# Altium schematic sheet ESP32.SchDoc
size A4; SheetNumber: 6; SheetTotal: 8
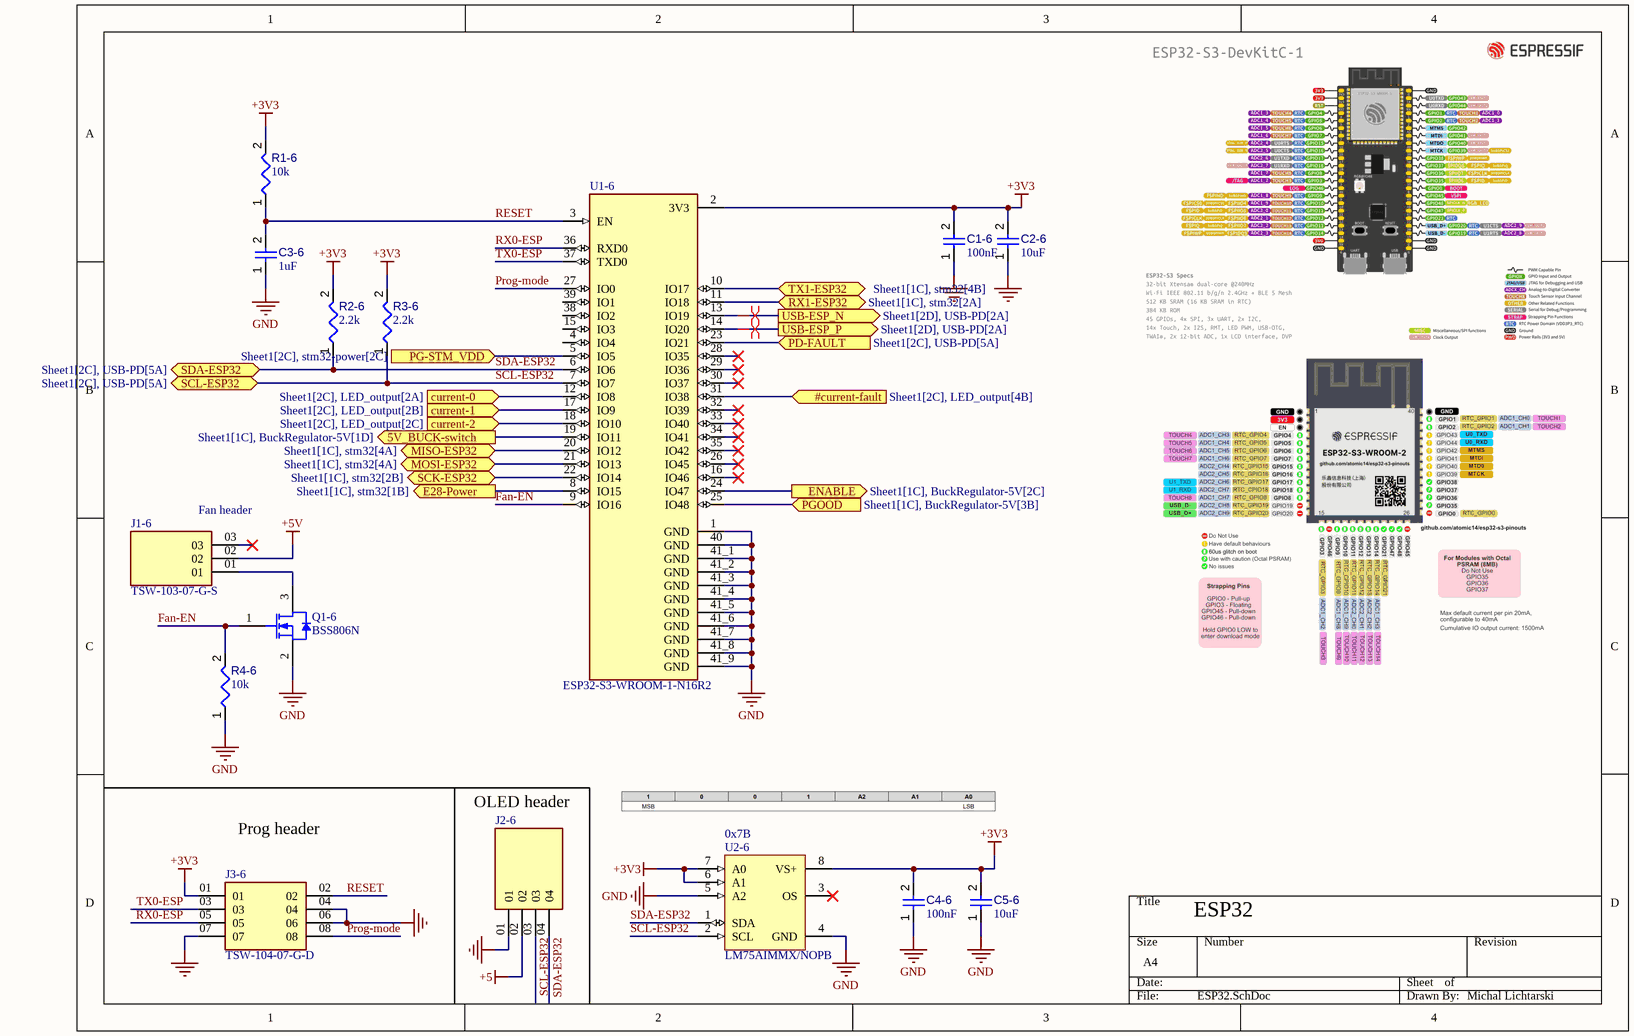
[diagram p0: ESP32.SchDoc]

## Parts
C1-6  value 100nF  [CAPC1608X94X35NL15T15]  (hidden comment: 100nF 0603)
C2-6  value 10uF  [CAPC1608X94X35NL15T15]  (hidden comment: 10uF 0603)
C3-6  value 1uF  [CAPC1608X94X35NL15T15]  (hidden comment: 1uF 0603)
C4-6  value 100nF  [CAPC1608X94X35NL15T15]  (hidden comment: 100nF 0603)
C5-6  value 10uF  [CAPC1608X94X35NL15T15]  (hidden comment: 10uF 0603)
J1-6  TSW-103-07-G-S  [SAMTEC_TSW-103-07-G-S]
J2-6  TSW-104-07-G-S  [SAMTEC_TSW-104-07-G-S]  (value not drawn)
J3-6  TSW-104-07-G-D  [SAMTEC_TSW-104-07-G-D]
Q1-6  BSS806N  [INF-PG-SOT23_M]
R1-6  10k  [RESC1608X55X25ML10T15]
R2-6  2.2k  [RESC1608X55X25ML10T15]
R3-6  2.2k  [RESC1608X55X25ML10T15]
R4-6  10k  [RESC1608X55X25ML10T15]
U1-6  ESP32-S3-WROOM-1-N16R2  [XCVR_ESP32-S3-WROOM-1-N16R2]
U2-6  LM75AIMMX/NOPB  [DGK0008A_M]

## Ports
5V_BUCK-switch (out, see Sheet1[1C], BuckRegulator-5V[1D]), #current-fault (in, see Sheet1[2C], LED_output[4B]), current-0 (in, see Sheet1[2C], LED_output[2A]), current-1 (in, see Sheet1[2C], LED_output[2B]), current-2 (in, see Sheet1[2C], LED_output[2C]), E28-Power (out, see Sheet1[1C], stm32[1B]), ENABLE (out, see Sheet1[1C], BuckRegulator-5V[2C]), MISO-ESP32 (bidir, see Sheet1[1C], stm32[4A]), MOSI-ESP32 (bidir, see Sheet1[1C], stm32[4A]), PD-FAULT (in, see Sheet1[2C], USB-PD[5A]), PG-STM_VDD (in, see Sheet1[2C], stm32-power[2C]), PGOOD (in, see Sheet1[1C], BuckRegulator-5V[3B]), RX1-ESP32 (bidir, see Sheet1[1C], stm32[2A]), SCK-ESP32 (bidir, see Sheet1[1C], stm32[2B]), SCL-ESP32 (bidir, see Sheet1[2C], USB-PD[5A]), SDA-ESP32 (bidir, see Sheet1[2C], USB-PD[5A]), TX1-ESP32 (bidir, see Sheet1[1C], stm32[4B]), USB-ESP_N (out, see Sheet1[2D], USB-PD[2A]), USB-ESP_P (out, see Sheet1[2D], USB-PD[2A])

## Nets
+3V3: C1-6.2 C2-6.2 C4-6.2 C5-6.2 J3-6.01 R1-6.2 R2-6.2 R3-6.2 U1-6.2(3V3) U2-6.6(A1) U2-6.7(A0) U2-6.8(VS+)
+5: J2-6.02
+5V: J1-6.02
GND: C1-6.1 C2-6.1 C3-6.1 C4-6.1 C5-6.1 J2-6.01 J3-6.04 J3-6.06 J3-6.07 Q1-6.2(SOURCE) R4-6.1 U1-6.1(GND) U1-6.40(GND) U1-6.41_1(GND) U1-6.41_2(GND) U1-6.41_3(GND) U1-6.41_4(GND) U1-6.41_5(GND) U1-6.41_6(GND) U1-6.41_7(GND) U1-6.41_8(GND) U1-6.41_9(GND) U2-6.4(GND) U2-6.5(A2)
5V_BUCK-switch: U1-6.19(IO11) ; port 5V_BUCK-switch
#current-fault: U1-6.31(IO38) ; port #current-fault
current-0: U1-6.12(IO8) ; port current-0
current-1: U1-6.17(IO9) ; port current-1
current-2: U1-6.18(IO10) ; port current-2
E28-Power: U1-6.8(IO15) ; port E28-Power
ENABLE: U1-6.24(IO47) ; port ENABLE
Fan-EN: Q1-6.1(GATE) R4-6.2 U1-6.9(IO16)
MISO-ESP32: U1-6.20(IO12) ; port MISO-ESP32
MOSI-ESP32: U1-6.21(IO13) ; port MOSI-ESP32
PD-FAULT: U1-6.23(IO21) ; port PD-FAULT
PG-STM_VDD: U1-6.5(IO5) ; port PG-STM_VDD
PGOOD: U1-6.25(IO48) ; port PGOOD
Prog-mode: J3-6.08 U1-6.27(IO0)
RESET: C3-6.2 J3-6.02 R1-6.1 U1-6.3(EN)
RX0-ESP: J3-6.05 U1-6.36(RXD0)
RX1-ESP32: U1-6.11(IO18) ; port RX1-ESP32
SCK-ESP32: U1-6.22(IO14) ; port SCK-ESP32
SCL-ESP32: J2-6.03 R3-6.1 U1-6.7(IO7) U2-6.2(SCL) ; port SCL-ESP32
SDA-ESP32: J2-6.04 R2-6.1 U1-6.6(IO6) U2-6.1(SDA) ; port SDA-ESP32
TX0-ESP: J3-6.03 U1-6.37(TXD0)
TX1-ESP32: U1-6.10(IO17) ; port TX1-ESP32
USB-ESP_N: U1-6.13(IO19) ; port USB-ESP_N
USB-ESP_P: U1-6.14(IO20) ; port USB-ESP_P
NetJ1-6_01: J1-6.01 Q1-6.3(DRAIN)

Not connected (* = marked no-connect by the designer): J1-6 03*; U1-6 4(IO4) 15(IO3) 16(IO46)* 26(IO45)* 28(IO35)* 29(IO36)* 30(IO37)* 32(IO39)* 33(IO40)* 34(IO41)* 35(IO42)* 38(IO2) 39(IO1); U2-6 3(OS)*

## Layout directives
differential pair: USB-ESP_N, USB-ESP_P

## Notes on the sheet
- (near J1-6) Fan header
- Prog header
- OLED header
- (near U2-6) 0x7B
- ESP32
- Michal Lichtarski

## Library data of the parts
C1-6 C2-6 C3-6 C4-6 C5-6 = CMP-001-00003-6: Tolerance: 10%; Voltage Rating: 16V; Capacitor Type: Ceramic; Max Operating Temperature: 125°C; Pins: 2; Min Operating Temperature: -55°C; RoHS Compliant: True; Mounting Technology: SM; Case/Package: 0603
J1-6 = TSW-103-07-G-S: MF: {'manufacturer': u'Samtec'}; Package: None; Price: None; Value: *; MP: TSW-103-07-G-S; Availability: Unavailable
J2-6 = TSW-104-07-G-S: MF: {'manufacturer': u'Samtec'}; Package: None; Price: None; Value: *; MP: TSW-104-07-G-S; Availability: Unavailable
J3-6 = TSW-104-07-G-D: MF: {'manufacturer': u'Samtec'}; Package: None; Price: None; Value: *; MP: TSW-104-07-G-D; Availability: Unavailable
Q1-6 = CMP-1149-00036-1: N-Channel OptiMOS 2 Small-Signal-Transistor, 20 V VDS, 2.3 A ID, -55 to 150 degC, PG-SOT23, Reel, Green; Manufacturer: Infineon; VDS (max): 20 V; RthJA (max): 250 K/W; VGS(th) (max): 0.75Â V; QG: 1.7Â nC; RDS (on) (max) (@2.5V): 57 mOhm; VGS(th) (min): 0.3Â V; Ptot (max): 0.5Â W; Green: TRUE; IDpuls (max): 9.3Â A; ID (max): 2.3Â A; RDS (on) (max) (@1.8V): 82 mOhm; Halogen-free: TRUE; PackageVersion: Apr-08; PackageReference: PG-SOT23; PackageDescription: 3-Pin Small Outline Transistor Package, 2.9 x 1.3 mm Body, 0.95 mm Pitch; ComponentLink3URL: http://www.infineon.com/dgdl/SOT23-Package_Overview.pdf?folderId=db3a30431936bc4b0119532290053c66&fileId=db3a30431936bc4b0119533468123c85; ComponentLink3Description: Package Specification; ComponentLink2Description: Datasheet; Packing: Reel; Mounting Technology: Surface Mount; PartNumber: BSS806N; RDS (on) (max): 57 mOhm; ComponentLink2URL: http://www.infineon.com/dgdl/BSS806N_Rev2.3_.pdf?folderId=db3a3043156fd573011622e10b5c1f67&fileId=db3a304330f686060131185f0553451c; ComponentLink1URL: http://www.infineon.com/; ComponentLink1Description: Manufacturer URL; DatasheetVersion: Rev. 2.3
R1-6 R2-6 R3-6 R4-6 = CMP-009-00031-5: Tolerance: 1%; Power: 100mW; Mounting Technology: SM; Case/Package: 0603; RoHS Compliant: True; Pins: 2; Min Operating Temperature: -55°C; Max Operating Temperature: 155°C
  R1-6 R4-6: Value: 10k
  R2-6 R3-6: Value: 2.2k
U1-6 = ESP32-S3-WROOM-1-N16R2: MF: {'manufacturer': u'Espressif Systems'}; Package: None; Price: None; Value: *; MP: ESP32-S3-WROOM-1-N16R2; Availability: Unavailable
U2-6 = CMP-0066-00343-3: Digital Temperature Sensor and Thermal Watchdog with Two-Wire Interface, 8-pin Mini SOIC, Pb-Free; Manufacturer: Texas Instruments; PowerWise: N; CompType: Temp Sensor IC; PackageTopMarking: ZXTT*T00A; PackageReference: DGK0008A; Code_JEDEC: MO-187-AA; PinCount: 8; PackageDescription: MINI SOIC, .118 x .118 x .034in, 8 Lead, .0256in Pitch; ComponentLink1URL: http://www.ti.com/general/docs/lit/getliterature.tsp?genericPartNumber=LM75A&fileType=pdf; RoHS: Y; ComponentLink1Description: Datasheet URL